# Altium project llrf_afe.PrjPcb (part 4 of 4)

## Sheet llrf_afe_fmc.SchDoc: =GlobalProjectName
size 410 x 297 mm; Author: Styuf Alexey; Organization: CosyLab Siberia; Revision: v0.8; SheetNumber: 14; SheetTotal: 20; PageSetup: Record=PageOptions|CenterHorizontal=True|CenterVertical=True|PrintScale=1.00|XCorrection=1.00|YCorrection=1.00|PrintKind=1|BorderSize=5000000|LeftOffset=0|BottomOffset=0|Orientation=2|PaperLength=1000|PaperWidth=1000|Scale=100|PaperSource=15|PrintQuality=1200|MediaType=1|DitherType=10|PaperKind=A3|PrintScaleMode=1; Weight: -; ScaleFactor: -
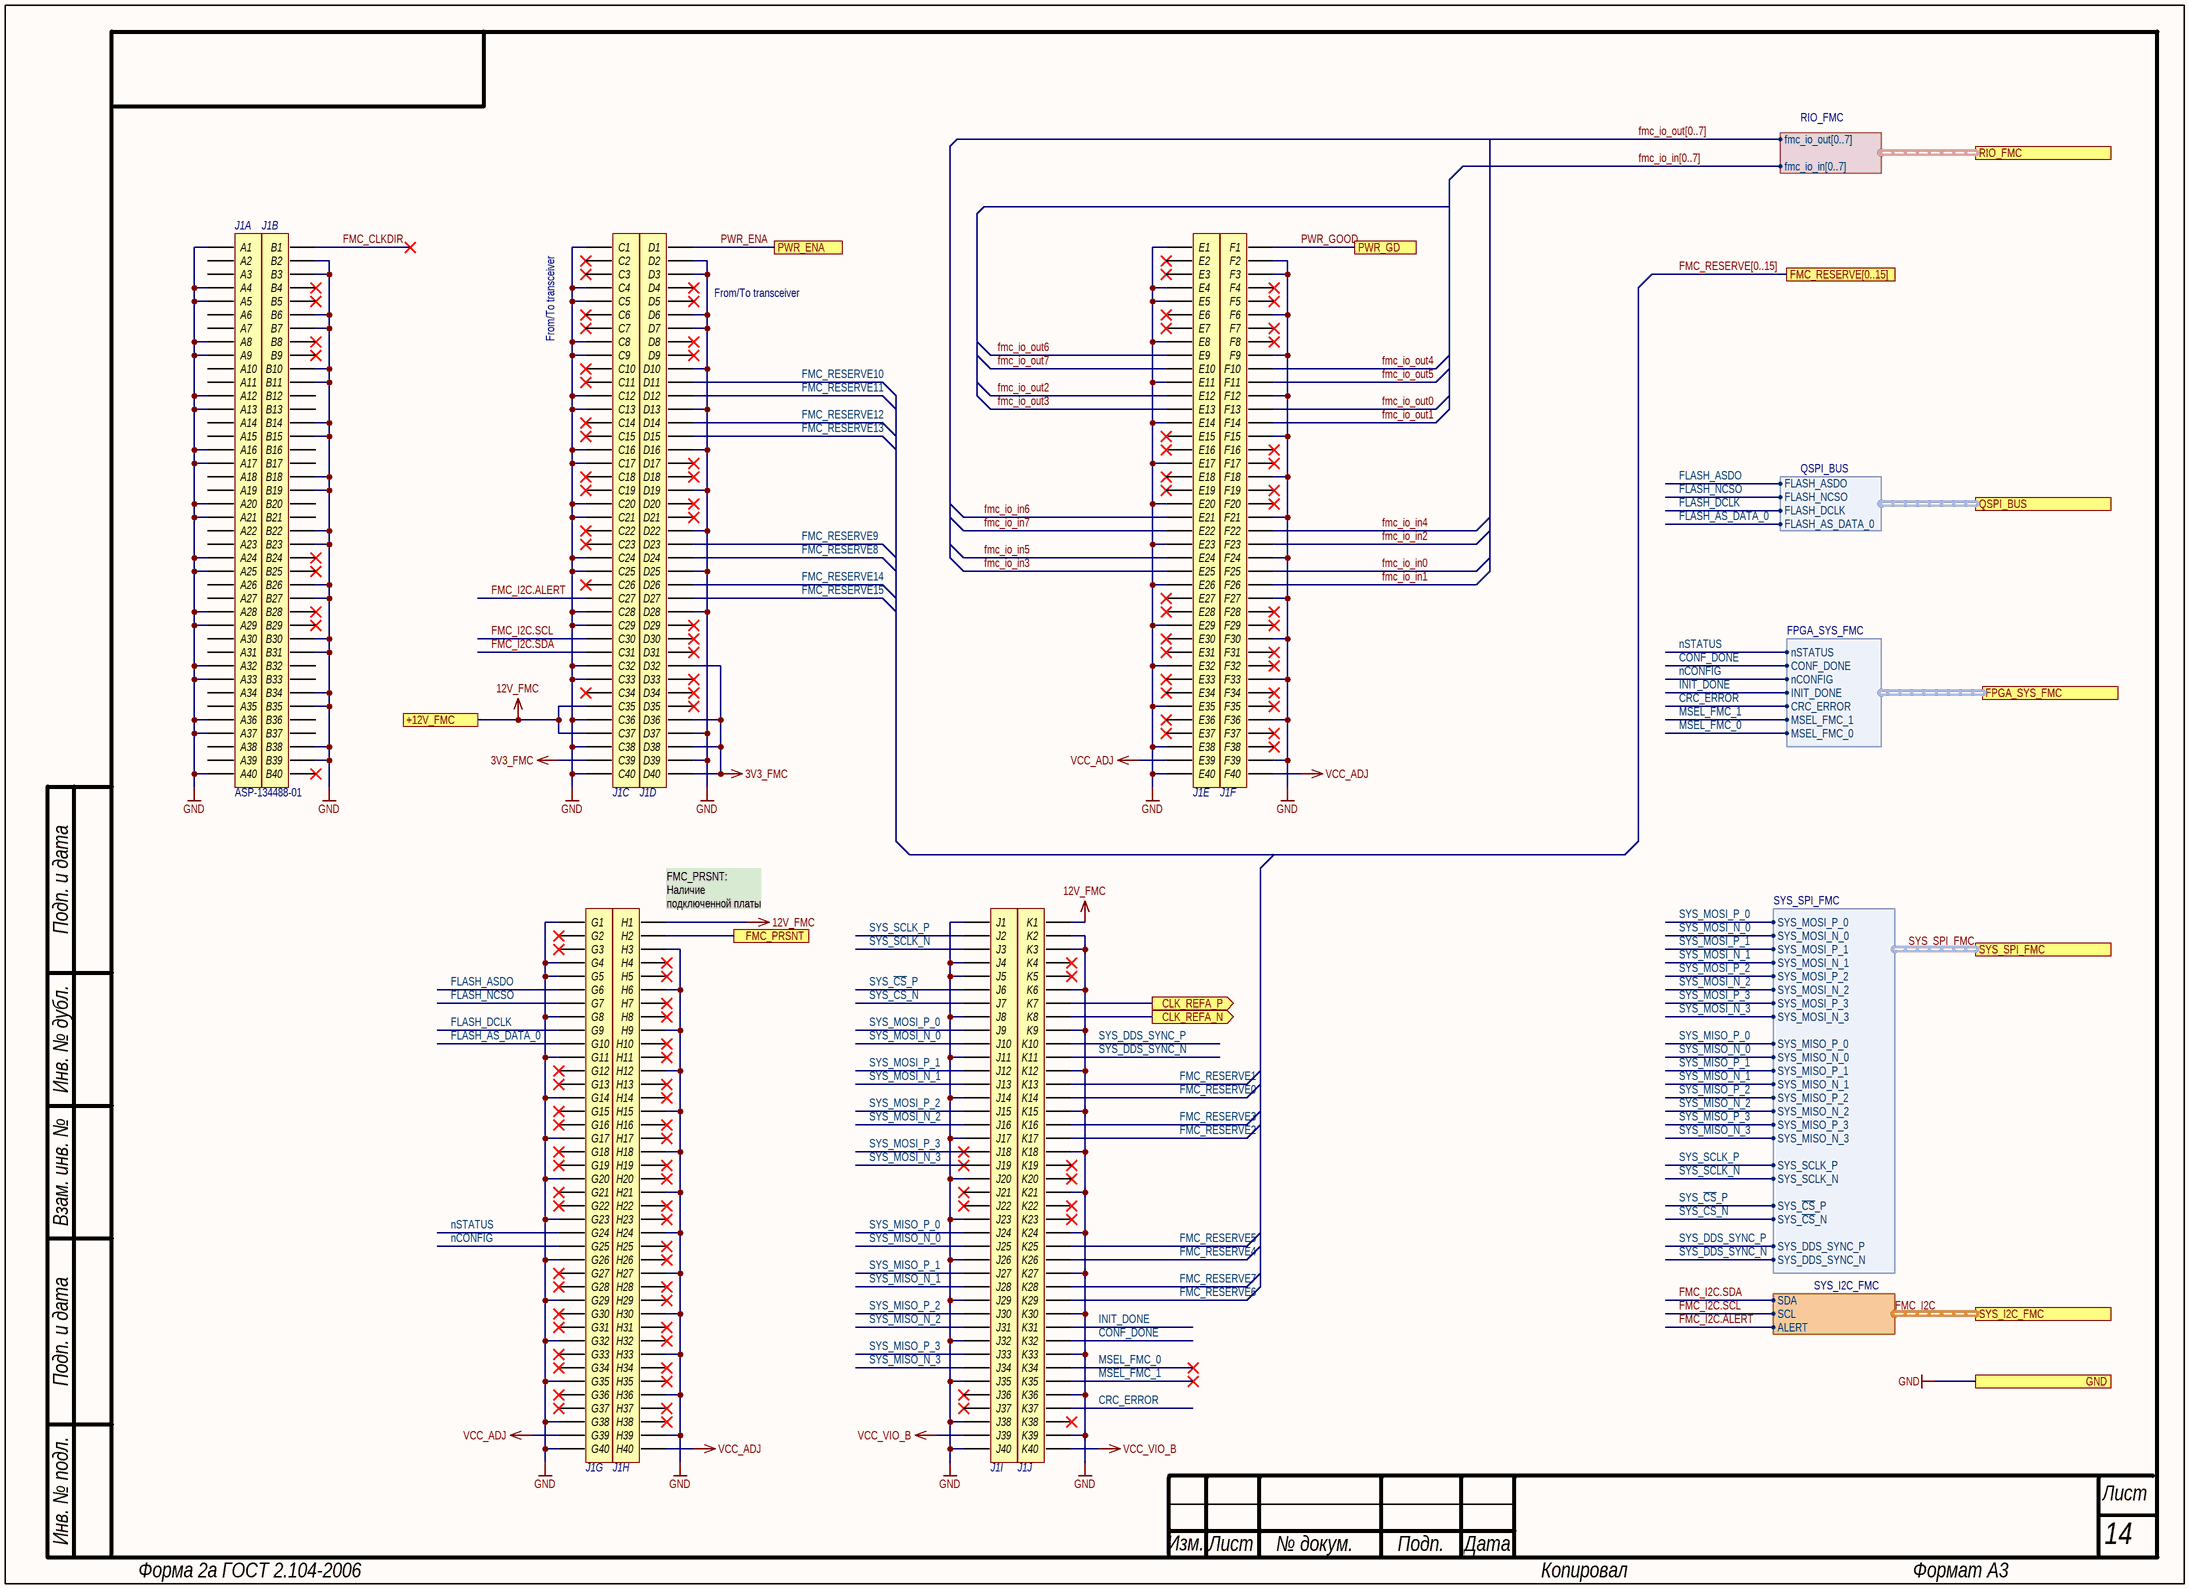
[diagram p22: llrf_afe_fmc.SchDoc]

### Parts
J1  ASP-134488-01  [ASP-134488-01]  (parts A,B,C,D,E,F,G,H,I,J of 10)

### Ports
+12V_FMC, CLK_REFA_N (out), CLK_REFA_P (out), FMC_PRSNT, FMC_RESERVE[0..15], FPGA_SYS_FMC (harness FPGA_SYS_FMC), GND, PWR_ENA, PWR_GD, QSPI_BUS (harness QSPI_BUS), RIO_FMC (harness RIO_FMC), SYS_I2C_FMC (harness SYS_I2C_FMC), SYS_SPI_FMC (harness SYS_SPI_FMC)

### Harnesses
RIO_FMC: fmc_io_out[0..7], fmc_io_in[0..7]
SYS_I2C_FMC: SDA, SCL, ALERT
SYS_SPI_FMC: SYS_MOSI_P_0, SYS_SCLK_P, SYS_~{CS}_P, SYS_MOSI_P_1, SYS_MOSI_P_2, SYS_MOSI_P_3, SYS_MOSI_N_0, SYS_MOSI_N_1, SYS_MOSI_N_2, SYS_MOSI_N_3, SYS_MISO_P_0, SYS_MISO_P_1, SYS_MISO_P_2, SYS_MISO_P_3, SYS_MISO_N_0, SYS_MISO_N_1, SYS_MISO_N_2, SYS_MISO_N_3, SYS_SCLK_N, SYS_DDS_SYNC_P, SYS_~{CS}_N, SYS_DDS_SYNC_N
QSPI_BUS: FLASH_ASDO, FLASH_NCSO, FLASH_DCLK, FLASH_AS_DATA_0
FPGA_SYS_FMC: INIT_DONE, nSTATUS, CONF_DONE, nCONFIG, MSEL_FMC_0, MSEL_FMC_1, CRC_ERROR

### Nets
3V3_FMC: J1.C39 J1.D32 J1.D36 J1.D38 J1.D40
12V_FMC: J1.C35 J1.C37 J1.H1 J1.K1 ; port +12V_FMC  [project net +12V_FMC]
GND: J1.A1 J1.A4 J1.A5 J1.A8 J1.A9 J1.A12 J1.A13 J1.A16 J1.A17 J1.A20 J1.A21 J1.A24 J1.A25 J1.A28 J1.A29 J1.A32 J1.A33 J1.A36 J1.A37 J1.A40 J1.B2 J1.B3 J1.B6 J1.B7 J1.B10 J1.B11 J1.B14 J1.B15 J1.B18 J1.B19 J1.B22 J1.B23 J1.B26 J1.B27 J1.B30 J1.B31 J1.B34 J1.B35 J1.B38 J1.B39 J1.C1 J1.C4 J1.C5 J1.C8 J1.C9 J1.C12 J1.C13 J1.C16 J1.C17 J1.C20 J1.C21 J1.C24 J1.C25 J1.C28 J1.C29 J1.C32 J1.C33 J1.C36 J1.C38 J1.C40 J1.D2 J1.D3 J1.D6 J1.D7 J1.D10 J1.D13 J1.D16 J1.D19 J1.D22 J1.D25 J1.D28 J1.D37 J1.D39 J1.E1 J1.E4 J1.E5 J1.E8 J1.E11 J1.E14 J1.E17 J1.E20 J1.E23 J1.E26 J1.E29 J1.E32 J1.E35 J1.E38 J1.E40 J1.F2 J1.F3 J1.F6 J1.F9 J1.F12 J1.F15 J1.F18 J1.F21 J1.F24 J1.F27 J1.F30 J1.F33 J1.F36 J1.F39 J1.G1 J1.G4 J1.G5 J1.G8 J1.G11 J1.G14 J1.G17 J1.G20 J1.G23 J1.G26 J1.G29 J1.G32 J1.G35 J1.G38 J1.G40 J1.H3 J1.H6 J1.H9 J1.H12 J1.H15 J1.H18 J1.H21 J1.H24 J1.H27 J1.H30 J1.H33 J1.H36 J1.H39 J1.J1 J1.J4 J1.J5 J1.J8 J1.J11 J1.J14 J1.J17 J1.J20 J1.J23 J1.J26 J1.J29 J1.J32 J1.J35 J1.J38 J1.J40 J1.K2 J1.K3 J1.K6 J1.K9 J1.K12 J1.K15 J1.K18 J1.K21 J1.K24 J1.K27 J1.K30 J1.K33 J1.K36 J1.K39 ; port GND
VCC_ADJ: J1.E39 J1.F40 J1.G39 J1.H40
VCC_VIO_B: J1.J39 J1.K40
CONF_DONE: J1.K32 ; port FPGA_SYS_FMC.CONF_DONE  [project net FPGA_SYS.CONF_DONE]
CRC_ERROR: J1.K37 ; port FPGA_SYS_FMC.CRC_ERROR  [project net FPGA_SYS.CRC_ERROR]
FLASH_AS_DATA_0: J1.G10 ; port QSPI_BUS.FLASH_AS_DATA_0
FLASH_ASDO: J1.G6 ; port QSPI_BUS.FLASH_ASDO
FLASH_DCLK: J1.G9 ; port QSPI_BUS.FLASH_DCLK
FLASH_NCSO: J1.G7 ; port QSPI_BUS.FLASH_NCSO
FMC_CLKDIR: J1.B1
FMC_I2C.ALERT: J1.C27 ; port SYS_I2C_FMC.ALERT
FMC_I2C.SCL: J1.C30 ; port SYS_I2C_FMC.SCL
FMC_I2C.SDA: J1.C31 ; port SYS_I2C_FMC.SDA
fmc_io_in0: J1.F25
fmc_io_in1: J1.F26
fmc_io_in2: J1.F23
fmc_io_in3: J1.E25
fmc_io_in4: J1.F22
fmc_io_in5: J1.E24
fmc_io_in6: J1.E21
fmc_io_in7: J1.E22
fmc_io_out0: J1.F13
fmc_io_out1: J1.F14
fmc_io_out2: J1.E12
fmc_io_out3: J1.E13
fmc_io_out4: J1.F10
fmc_io_out5: J1.F11
fmc_io_out6: J1.E9
fmc_io_out7: J1.E10
FMC_PRSNT: J1.H2 ; port FMC_PRSNT
FMC_RESERVE0: J1.K14
FMC_RESERVE1: J1.K13
FMC_RESERVE2: J1.K17
FMC_RESERVE3: J1.K16
FMC_RESERVE4: J1.K26
FMC_RESERVE5: J1.K25
FMC_RESERVE6: J1.K29
FMC_RESERVE7: J1.K28
FMC_RESERVE8: J1.D24
FMC_RESERVE9: J1.D23
FMC_RESERVE10: J1.D11
FMC_RESERVE11: J1.D12
FMC_RESERVE12: J1.D14
FMC_RESERVE13: J1.D15
FMC_RESERVE14: J1.D26
FMC_RESERVE15: J1.D27
INIT_DONE: J1.K31 ; port FPGA_SYS_FMC.INIT_DONE  [project net FPGA_SYS.INIT_DONE]
MSEL_FMC_0: J1.K34 ; port FPGA_SYS_FMC.MSEL_FMC_0
MSEL_FMC_1: J1.K35 ; port FPGA_SYS_FMC.MSEL_FMC_1
nCONFIG: J1.G25 ; port FPGA_SYS_FMC.nCONFIG  [project net FPGA_SYS.nCONFIG]
nSTATUS: J1.G24 ; port FPGA_SYS_FMC.nSTATUS  [project net FPGA_SYS.nSTATUS]
PWR_ENA: J1.D1 ; port PWR_ENA
PWR_GOOD: J1.F1 ; port PWR_GD  [project net PWR_GD]
REFA_N: J1.K8 ; port CLK_REFA_N
REFA_P: J1.K7 ; port CLK_REFA_P
SYS_~{CS}_N: J1.J7 ; port SYS_SPI_FMC.SYS_~{CS}_N  [project net SYS_SPI_FMC.SYS_~{CS}_N]
SYS_~{CS}_P: J1.J6 ; port SYS_SPI_FMC.SYS_~{CS}_P  [project net SYS_SPI_FMC.SYS_~{CS}_P]
SYS_DDS_SYNC_N: J1.K11 ; port SYS_SPI_FMC.SYS_DDS_SYNC_N  [project net SYS_SPI_FMC.SYS_DDS_SYNC_N]
SYS_DDS_SYNC_P: J1.K10 ; port SYS_SPI_FMC.SYS_DDS_SYNC_P  [project net SYS_SPI_FMC.SYS_DDS_SYNC_P]
SYS_MISO_N_0: J1.J25 ; port SYS_SPI_FMC.SYS_MISO_N_0  [project net SYS_SPI_FMC.SYS_MISO_N_0]
SYS_MISO_N_1: J1.J28 ; port SYS_SPI_FMC.SYS_MISO_N_1  [project net SYS_SPI_FMC.SYS_MISO_N_1]
SYS_MISO_N_2: J1.J31 ; port SYS_SPI_FMC.SYS_MISO_N_2  [project net SYS_SPI_FMC.SYS_MISO_N_2]
SYS_MISO_N_3: J1.J34 ; port SYS_SPI_FMC.SYS_MISO_N_3  [project net SYS_SPI_FMC.SYS_MISO_N_3]
SYS_MISO_P_0: J1.J24 ; port SYS_SPI_FMC.SYS_MISO_P_0  [project net SYS_SPI_FMC.SYS_MISO_P_0]
SYS_MISO_P_1: J1.J27 ; port SYS_SPI_FMC.SYS_MISO_P_1  [project net SYS_SPI_FMC.SYS_MISO_P_1]
SYS_MISO_P_2: J1.J30 ; port SYS_SPI_FMC.SYS_MISO_P_2  [project net SYS_SPI_FMC.SYS_MISO_P_2]
SYS_MISO_P_3: J1.J33 ; port SYS_SPI_FMC.SYS_MISO_P_3  [project net SYS_SPI_FMC.SYS_MISO_P_3]
SYS_MOSI_N_0: J1.J10 ; port SYS_SPI_FMC.SYS_MOSI_N_0  [project net SYS_SPI_FMC.SYS_MOSI_N_0]
SYS_MOSI_N_1: J1.J13 ; port SYS_SPI_FMC.SYS_MOSI_N_1  [project net SYS_SPI_FMC.SYS_MOSI_N_1]
SYS_MOSI_N_2: J1.J16 ; port SYS_SPI_FMC.SYS_MOSI_N_2  [project net SYS_SPI_FMC.SYS_MOSI_N_2]
SYS_MOSI_N_3: J1.J19 ; port SYS_SPI_FMC.SYS_MOSI_N_3  [project net SYS_SPI_FMC.SYS_MOSI_N_3]
SYS_MOSI_P_0: J1.J9 ; port SYS_SPI_FMC.SYS_MOSI_P_0  [project net SYS_SPI_FMC.SYS_MOSI_P_0]
SYS_MOSI_P_1: J1.J12 ; port SYS_SPI_FMC.SYS_MOSI_P_1  [project net SYS_SPI_FMC.SYS_MOSI_P_1]
SYS_MOSI_P_2: J1.J15 ; port SYS_SPI_FMC.SYS_MOSI_P_2  [project net SYS_SPI_FMC.SYS_MOSI_P_2]
SYS_MOSI_P_3: J1.J18 ; port SYS_SPI_FMC.SYS_MOSI_P_3  [project net SYS_SPI_FMC.SYS_MOSI_P_3]
SYS_SCLK_N: J1.J3 ; port SYS_SPI_FMC.SYS_SCLK_N  [project net SYS_SPI_FMC.SYS_SCLK_N]
SYS_SCLK_P: J1.J2 ; port SYS_SPI_FMC.SYS_SCLK_P  [project net SYS_SPI_FMC.SYS_SCLK_P]

Not connected (* = marked no-connect by the designer): J1 A2 A3 A6 A7 A10 A11 A14 A15 A18 A19 A22 A23 A26 A27 A30 A31 A34 A35 A38 A39 B4* B5* B8* B9* B12 B13 B16 B17 B20 B21 B24* B25* B28* B29* B32 B33 B36 B37 B40* C2* C3* C6* C7* C10* C11* C14* C15* C18* C19* C22* C23* C26* C34* D4* D5* D8* D9* D17* D18* D20* D21* D29* D30* D31* D33* D34* D35* E2* E3* E6* E7* E15* E16* E18* E19* E27* E28* E30* E31* E33* E34* E36* E37* F4* F5* F7* F8* F16* F17* F19* F20* F28* F29* F31* F32* F34* F35* F37* F38* G2* G3* G12* G13* G15* G16* G18* G19* G21* G22* G27* G28* G30* G31* G33* G34* G36* G37* H4* H5* H7* H8* H10* H11* H13* H14* H16* H17* H19* H20* H22* H23* H25* H26* H28* H29* H31* H32* H34* H35* H37* H38* J21* J22* J36* J37* K4* K5* K19* K20* K22* K23* K38*

### Buses and harness runs
bus fmc_io_in[0..7]
bus fmc_io_out[0..7]
bus FMC_RESERVE[0..15] = port FMC_RESERVE[0..15]
harness FMC_I2C = port SYS_I2C_FMC
harness SYS_SPI_FMC = port SYS_SPI_FMC

### Notes on the sheet
- (near J1) From/To transceiver
- (near J1) FMC_PRSNT:
  Наличие подключенной платы
- Подп. и дата
- Инв. № дубл.
- Взам. инв. №
- Инв. № подл.
- Изм.
- Лист
- № докум.
- Подп.
- Дата
- Форма 2а ГОСТ 2.104-2006
- Копировал
- Формат А3

### Library data of the parts
J1 = ASP-134488-01: Socket Array Assembly, Surface Mount, 0.050" Pitch, 400 Pins; MANUFACTURER: SAMTEC; PCB DECAL: SEAF-40-XX.X-XX-10-X-A; Потребление, Вт: 0,0; Назначение: FMC HPC socket Array Assembly, Surface Mount, 0.050" Pitch, 400 Pins; CREATED: March 24, 2015 - Wendy Xin; ComponentLink1Description: DataSheet; ComponentLink1URL: https://suddendocs.samtec.com/prints/asp-134488-01-mkt.pdf; Supplier 1: Digi-Key; Supplier Part Number 1: SAM8730-ND; Наименование: ASP-134488-01

## Nets that join several sheets
1V2: pwr/1V2_ctrl (R51_1V2_ctrl.1 TP14_1V2_ctrl.0 U14_1V2_ctrl.8 U14_1V2_ctrl.9), llrf_afe_fpga_pwr (56 pins)
1V8: llrf_afe_dds_clock (C115.2 L21.1), pwr/1V8_ctrl (R51_1V8_ctrl.1 TP14_1V8_ctrl.0 U14_1V8_ctrl.8 U14_1V8_ctrl.9), dds_channel_1 (9 pins), dds_channel_2 (9 pins)
2V5: llrf_afe_mfm (C4.2 C5.2 U3.2), pwr/2V5_ctrl (R51_2V5_ctrl.1 TP14_2V5_ctrl.0 U14_2V5_ctrl.8 U14_2V5_ctrl.9), llrf_afe_fpga_pwr (36 pins), llrf_afe_fpga_conf (11 pins)
3V3: llrf_afe_main (6 pins), llrf_afe_mfm (U3.15), llrf_afe_mfm_rio (C127.2 C128.2 U17.8), RIO/llrf_rio_ch0 (C38_llrf_rio_ch0.2 C39_llrf_rio_ch0.2 U7_llrf_rio_ch0.8), RIO/llrf_rio_ch1 (C38_llrf_rio_ch1.2 C39_llrf_rio_ch1.2 U7_llrf_rio_ch1.8), RIO/llrf_rio_ch2 (C38_llrf_rio_ch2.2 C39_llrf_rio_ch2.2 U7_llrf_rio_ch2.8), RIO/llrf_rio_ch3 (C38_llrf_rio_ch3.2 C39_llrf_rio_ch3.2 U7_llrf_rio_ch3.8), RIO/llrf_rio_ch4 (C38_llrf_rio_ch4.2 C39_llrf_rio_ch4.2 U7_llrf_rio_ch4.8), RIO/llrf_rio_ch5 (C38_llrf_rio_ch5.2 C39_llrf_rio_ch5.2 U7_llrf_rio_ch5.8), RIO/llrf_rio_ch6 (C38_llrf_rio_ch6.2 C39_llrf_rio_ch6.2 U7_llrf_rio_ch6.8), RIO/llrf_rio_ch7 (C38_llrf_rio_ch7.2 C39_llrf_rio_ch7.2 U7_llrf_rio_ch7.8), llrf_afe_system_ctrl (8 pins), llrf_afe_front_panel (X12.1 X12.3), llrf_afe_dds_clock (6 pins), llrf_afe_pwr (R29.1), pwr/3V3_ctrl (10 pins), pwr/2V5_ctrl (5 pins), pwr/1V8_ctrl (6 pins), pwr/12V_ctrl (5 pins), pwr/1V2_ctrl (6 pins), llrf_afe_fpga_pwr (32 pins), llrf_afe_usb_ftdi (6 pins), llrf_afe_fpga_conf (10 pins), dds_channel_1 (C23_dds_channel_1.2 C24_dds_channel_1.2 L7_dds_channel_1.1 U1_dds_channel_1.27), dds_channel_1/dds_filter_1 (10 pins), dds_channel_1/dds_filter_2 (10 pins), dds_channel_2 (C23_dds_channel_2.2 C24_dds_channel_2.2 L7_dds_channel_2.1 U1_dds_channel_2.27), dds_channel_2/dds_filter_1 (10 pins), dds_channel_2/dds_filter_2 (10 pins)
12V: llrf_afe_pwr (C47.1 G1.1), pwr/3V3_pwr (C55_3V3_pwr.2 C164_3V3_pwr.2 R_EN1_3V3_pwr.2 U21_3V3_pwr.6), pwr/2V5_pwr (C55_2V5_pwr.2 C164_2V5_pwr.2 R_EN1_2V5_pwr.2 U21_2V5_pwr.6), pwr/1V8_pwr (C55_1V8_pwr.2 C164_1V8_pwr.2 R_EN1_1V8_pwr.2 U21_1V8_pwr.6), pwr/12V_ctrl (R51_12V_ctrl.1 TP14_12V_ctrl.0 U14_12V_ctrl.8 U14_12V_ctrl.9), pwr/1V2_pwr (C55_1V2_pwr.2 C164_1V2_pwr.2 R_EN1_1V2_pwr.2 U21_1V2_pwr.6)
+5V: llrf_afe_pwr (C51.2 R36.2 U11.5), dds_channel_1 (C27_dds_channel_1.2 C28_dds_channel_1.2 L9_dds_channel_1.1), dds_channel_2 (C27_dds_channel_2.2 C28_dds_channel_2.2 L9_dds_channel_2.1)
+5V_A: dds_channel_1 (C29_dds_channel_1.2 C30_dds_channel_1.2 L9_dds_channel_1.2), dds_channel_1/dds_filter_1 (R126_dds_channel_1_dds_filter_1.1 R133_dds_channel_1_dds_filter_1.2), dds_channel_1/dds_filter_2 (R126_dds_channel_1_dds_filter_2.1 R133_dds_channel_1_dds_filter_2.2)
+5V_A: dds_channel_2 (C29_dds_channel_2.2 C30_dds_channel_2.2 L9_dds_channel_2.2), dds_channel_2/dds_filter_1 (R126_dds_channel_2_dds_filter_1.1 R133_dds_channel_2_dds_filter_1.2), dds_channel_2/dds_filter_2 (R126_dds_channel_2_dds_filter_2.1 R133_dds_channel_2_dds_filter_2.2)
+10V: llrf_afe_mfm (C173.2 C174.2 L2.1), llrf_afe_pwr (C44.2 R30.2 U9.5)
+12V_FMC: llrf_afe_pwr_input (5 pins), llrf_afe_fmc (J1.C35 J1.C37 J1.H1 J1.K1)
+12V_INPUT: llrf_afe_main (X1.1 X1.2 X1.3 X1.4), llrf_afe_pwr_input (5 pins)
-5V: llrf_afe_pwr (C54.1 R41.1 U12.5), dds_channel_1 (C31_dds_channel_1.2 C32_dds_channel_1.2 L10_dds_channel_1.1), dds_channel_2 (C31_dds_channel_2.2 C32_dds_channel_2.2 L10_dds_channel_2.1)
-5V_A: dds_channel_1 (C33_dds_channel_1.2 C34_dds_channel_1.2 L10_dds_channel_1.2), dds_channel_1/dds_filter_1 (R134_dds_channel_1_dds_filter_1.1), dds_channel_1/dds_filter_2 (R134_dds_channel_1_dds_filter_2.1)
-5V_A: dds_channel_2 (C33_dds_channel_2.2 C34_dds_channel_2.2 L10_dds_channel_2.2), dds_channel_2/dds_filter_1 (R134_dds_channel_2_dds_filter_1.1), dds_channel_2/dds_filter_2 (R134_dds_channel_2_dds_filter_2.1)
-10V: llrf_afe_mfm (C177.2 C178.2 L3.1), llrf_afe_pwr (C50.1 R35.1 U10.5)
AGND_DDS: dds_channel_1 (20 pins), dds_channel_1/dds_filter_1 (21 pins), dds_channel_1/dds_filter_2 (21 pins)
AGND_DDS: dds_channel_2 (20 pins), dds_channel_2/dds_filter_1 (21 pins), dds_channel_2/dds_filter_2 (21 pins)
GND: llrf_afe_main (10 pins), llrf_afe_mfm (5 pins), llrf_afe_mfm_rio (8 pins), RIO/llrf_rio_ch0 (5 pins), RIO/llrf_rio_ch1 (5 pins), RIO/llrf_rio_ch2 (5 pins), RIO/llrf_rio_ch3 (5 pins), RIO/llrf_rio_ch4 (5 pins), RIO/llrf_rio_ch5 (5 pins), RIO/llrf_rio_ch6 (5 pins), RIO/llrf_rio_ch7 (5 pins), llrf_afe_system_ctrl (11 pins), llrf_afe_fpga_bridge (12 pins), llrf_afe_front_panel (24 pins), llrf_afe_dds_clock (28 pins), llrf_afe_pwr (23 pins), pwr/3V3_pwr (10 pins), pwr/2V5_pwr (10 pins), pwr/1V8_pwr (10 pins), pwr/3V3_ctrl (C124_3V3_ctrl.1 D1_3V3_ctrl.2 R56_3V3_ctrl.1 U14_3V3_ctrl.7), pwr/2V5_ctrl (C124_2V5_ctrl.1 D1_2V5_ctrl.2 R56_2V5_ctrl.1 U14_2V5_ctrl.7), pwr/1V8_ctrl (C124_1V8_ctrl.1 D1_1V8_ctrl.2 U14_1V8_ctrl.7), pwr/12V_ctrl (5 pins), pwr/1V2_pwr (10 pins), pwr/1V2_ctrl (C124_1V2_ctrl.1 D1_1V2_ctrl.2 R55_1V2_ctrl.1 U14_1V2_ctrl.7), llrf_afe_pwr_input (16 pins), llrf_afe_fpga_pwr (105 pins), llrf_afe_usb_ftdi (13 pins), llrf_afe_fpga_conf (15 pins), llrf_afe_reserve_io (10 pins), dds_channel_1 (27 pins), dds_channel_1/dds_filter_1 (14 pins), dds_channel_1/dds_filter_2 (14 pins), dds_channel_2 (27 pins), dds_channel_2/dds_filter_1 (14 pins), dds_channel_2/dds_filter_2 (14 pins), llrf_afe_fmc (159 pins)
12V_OUT: pwr/12V_ctrl (R51_12V_ctrl.2 R52_12V_ctrl.1 U14_12V_ctrl.10), llrf_afe_pwr_input (5 pins)
B+: llrf_afe_mfm_rio (R74.2), llrf_afe_front_panel (X8.1)
B-: llrf_afe_mfm_rio (R76.2), llrf_afe_front_panel (X9.1)
B_REF: llrf_afe_mfm_rio (R72.2), llrf_afe_front_panel (X10.1)
~{CS}: llrf_afe_fpga_bridge (U8.H1), llrf_afe_dds_clock (U13.15)
CLK0_N: llrf_afe_dds_clock (U13.40), dds_channel_1 (C144_dds_channel_1.2)
CLK0_P: llrf_afe_dds_clock (U13.41), dds_channel_1 (C143_dds_channel_1.2)
CLK1_N: llrf_afe_dds_clock (U13.37), dds_channel_2 (C144_dds_channel_2.2)
CLK1_P: llrf_afe_dds_clock (U13.38), dds_channel_2 (C143_dds_channel_2.2)
CLK2_N: llrf_afe_fpga_bridge (C41.2), llrf_afe_dds_clock (U13.32)
CLK2_P: llrf_afe_fpga_bridge (C40.1), llrf_afe_dds_clock (U13.33)
CLK3_N: llrf_afe_fpga_bridge (C43.2), llrf_afe_dds_clock (U13.29)
CLK3_P: llrf_afe_fpga_bridge (C42.1), llrf_afe_dds_clock (U13.30)
CLK4_N: llrf_afe_main (R1.1), llrf_afe_dds_clock (U13.22)
CLK4_P: llrf_afe_main (R1.2), llrf_afe_dds_clock (U13.23)
CLK_REFB_N: llrf_afe_fpga_bridge (R175.2 R177.2), llrf_afe_dds_clock (C103.1)
CLK_REFB_P: llrf_afe_fpga_bridge (R175.1 R176.2), llrf_afe_dds_clock (C102.2)
DAC_OUT_N: dds_channel_1 (R110_dds_channel_1.2 U1_dds_channel_1.68), dds_channel_1/dds_filter_1 (R124_dds_channel_1_dds_filter_1.2 T1_dds_channel_1_dds_filter_1.6)
DAC_OUT_N: dds_channel_1 (R114_dds_channel_1.2 U1_dds_channel_1.60), dds_channel_1/dds_filter_2 (R124_dds_channel_1_dds_filter_2.2 T1_dds_channel_1_dds_filter_2.6)
DAC_OUT_N: dds_channel_2 (R110_dds_channel_2.2 U1_dds_channel_2.68), dds_channel_2/dds_filter_1 (R124_dds_channel_2_dds_filter_1.2 T1_dds_channel_2_dds_filter_1.6)
DAC_OUT_N: dds_channel_2 (R114_dds_channel_2.2 U1_dds_channel_2.60), dds_channel_2/dds_filter_2 (R124_dds_channel_2_dds_filter_2.2 T1_dds_channel_2_dds_filter_2.6)
DAC_OUT_P: dds_channel_1 (R109_dds_channel_1.2 U1_dds_channel_1.69), dds_channel_1/dds_filter_1 (R124_dds_channel_1_dds_filter_1.1 T1_dds_channel_1_dds_filter_1.4)
DAC_OUT_P: dds_channel_1 (R113_dds_channel_1.2 U1_dds_channel_1.59), dds_channel_1/dds_filter_2 (R124_dds_channel_1_dds_filter_2.1 T1_dds_channel_1_dds_filter_2.4)
DAC_OUT_P: dds_channel_2 (R109_dds_channel_2.2 U1_dds_channel_2.69), dds_channel_2/dds_filter_1 (R124_dds_channel_2_dds_filter_1.1 T1_dds_channel_2_dds_filter_1.4)
DAC_OUT_P: dds_channel_2 (R113_dds_channel_2.2 U1_dds_channel_2.59), dds_channel_2/dds_filter_2 (R124_dds_channel_2_dds_filter_2.1 T1_dds_channel_2_dds_filter_2.4)
DDS_BUS_1.DAC_RST: llrf_afe_fpga_bridge (U8.U7), dds_channel_1 (R121_dds_channel_1.2 U1_dds_channel_1.53)
DDS_BUS_1.FB1: llrf_afe_fpga_bridge (U8.Y3), dds_channel_1/dds_filter_1 (R136_dds_channel_1_dds_filter_1.1)
DDS_BUS_1.FB2: llrf_afe_fpga_bridge (U8.V5), dds_channel_1/dds_filter_2 (R136_dds_channel_1_dds_filter_2.1)
DDS_BUS_1.P1D0: llrf_afe_fpga_bridge (U8.AB7), dds_channel_1 (U1_dds_channel_1.22)
DDS_BUS_1.P1D1: llrf_afe_fpga_bridge (U8.AA7), dds_channel_1 (U1_dds_channel_1.21)
DDS_BUS_1.P1D2: llrf_afe_fpga_bridge (U8.AA8), dds_channel_1 (U1_dds_channel_1.20)
DDS_BUS_1.P1D3: llrf_afe_fpga_bridge (U8.AB8), dds_channel_1 (U1_dds_channel_1.19)
DDS_BUS_1.P1D4: llrf_afe_fpga_bridge (U8.Y8), dds_channel_1 (U1_dds_channel_1.18)
DDS_BUS_1.P1D5: llrf_afe_fpga_bridge (U8.AA9), dds_channel_1 (U1_dds_channel_1.17)
DDS_BUS_1.P1D6: llrf_afe_fpga_bridge (U8.AB9), dds_channel_1 (U1_dds_channel_1.16)
DDS_BUS_1.P1D7: llrf_afe_fpga_bridge (U8.Y10), dds_channel_1 (U1_dds_channel_1.15)
DDS_BUS_1.P1D8: llrf_afe_fpga_bridge (U8.AA10), dds_channel_1 (U1_dds_channel_1.14)
DDS_BUS_1.P1D9: llrf_afe_fpga_bridge (U8.AB10), dds_channel_1 (U1_dds_channel_1.13)
DDS_BUS_1.P1D10: llrf_afe_fpga_bridge (U8.W10), dds_channel_1 (U1_dds_channel_1.12)
DDS_BUS_1.P1D11: llrf_afe_fpga_bridge (U8.V11), dds_channel_1 (U1_dds_channel_1.11)
DDS_BUS_1.P1D12: llrf_afe_fpga_bridge (U8.U11), dds_channel_1 (U1_dds_channel_1.10)
DDS_BUS_1.P1D13: llrf_afe_fpga_bridge (U8.T11), dds_channel_1 (U1_dds_channel_1.9)
DDS_BUS_1.P2D0: llrf_afe_fpga_bridge (U8.V6), dds_channel_1 (U1_dds_channel_1.44)
DDS_BUS_1.P2D1: llrf_afe_fpga_bridge (U8.Y4), dds_channel_1 (U1_dds_channel_1.43)
DDS_BUS_1.P2D2: llrf_afe_fpga_bridge (U8.V7), dds_channel_1 (U1_dds_channel_1.42)
DDS_BUS_1.P2D3: llrf_afe_fpga_bridge (U8.W6), dds_channel_1 (U1_dds_channel_1.41)
DDS_BUS_1.P2D4: llrf_afe_fpga_bridge (U8.AA4), dds_channel_1 (U1_dds_channel_1.40)
DDS_BUS_1.P2D5: llrf_afe_fpga_bridge (U8.W7), dds_channel_1 (U1_dds_channel_1.39)
DDS_BUS_1.P2D6: llrf_afe_fpga_bridge (U8.AB4), dds_channel_1 (U1_dds_channel_1.38)
DDS_BUS_1.P2D7: llrf_afe_fpga_bridge (U8.AA5), dds_channel_1 (U1_dds_channel_1.37)
DDS_BUS_1.P2D8: llrf_afe_fpga_bridge (U8.U8), dds_channel_1 (U1_dds_channel_1.36)
DDS_BUS_1.P2D9: llrf_afe_fpga_bridge (U8.AB5), dds_channel_1 (U1_dds_channel_1.35)
DDS_BUS_1.P2D10: llrf_afe_fpga_bridge (U8.V8), dds_channel_1 (U1_dds_channel_1.34)
DDS_BUS_1.P2D11: llrf_afe_fpga_bridge (U8.AA6), dds_channel_1 (U1_dds_channel_1.33)
DDS_BUS_1.P2D12: llrf_afe_fpga_bridge (U8.AB6), dds_channel_1 (U1_dds_channel_1.32)
DDS_BUS_1.P2D13: llrf_afe_fpga_bridge (U8.Y7), dds_channel_1 (U1_dds_channel_1.31)
DDS_BUS_1.SLEEP: llrf_afe_fpga_bridge (U8.W8), dds_channel_1 (R174_dds_channel_1.2 U1_dds_channel_1.52)
DDS_BUS_2.DAC_RST: llrf_afe_fpga_bridge (U8.N7), dds_channel_2 (R121_dds_channel_2.2 U1_dds_channel_2.53)
DDS_BUS_2.FB1: llrf_afe_fpga_bridge (U8.Y2), dds_channel_2/dds_filter_1 (R136_dds_channel_2_dds_filter_1.1)
DDS_BUS_2.FB2: llrf_afe_fpga_bridge (U8.Y1), dds_channel_2/dds_filter_2 (R136_dds_channel_2_dds_filter_2.1)
DDS_BUS_2.P1D0: llrf_afe_fpga_bridge (U8.P7), dds_channel_2 (U1_dds_channel_2.22)
DDS_BUS_2.P1D1: llrf_afe_fpga_bridge (U8.R1), dds_channel_2 (U1_dds_channel_2.21)
DDS_BUS_2.P1D2: llrf_afe_fpga_bridge (U8.R2), dds_channel_2 (U1_dds_channel_2.20)
DDS_BUS_2.P1D3: llrf_afe_fpga_bridge (U8.R3), dds_channel_2 (U1_dds_channel_2.19)
DDS_BUS_2.P1D4: llrf_afe_fpga_bridge (U8.R5), dds_channel_2 (U1_dds_channel_2.18)
DDS_BUS_2.P1D5: llrf_afe_fpga_bridge (U8.T5), dds_channel_2 (U1_dds_channel_2.17)
DDS_BUS_2.P1D6: llrf_afe_fpga_bridge (U8.U1), dds_channel_2 (U1_dds_channel_2.16)
DDS_BUS_2.P1D7: llrf_afe_fpga_bridge (U8.U2), dds_channel_2 (U1_dds_channel_2.15)
DDS_BUS_2.P1D8: llrf_afe_fpga_bridge (U8.P6), dds_channel_2 (U1_dds_channel_2.14)
DDS_BUS_2.P1D9: llrf_afe_fpga_bridge (U8.V1), dds_channel_2 (U1_dds_channel_2.13)
DDS_BUS_2.P1D10: llrf_afe_fpga_bridge (U8.V2), dds_channel_2 (U1_dds_channel_2.12)
DDS_BUS_2.P1D11: llrf_afe_fpga_bridge (U8.R6), dds_channel_2 (U1_dds_channel_2.11)
DDS_BUS_2.P1D12: llrf_afe_fpga_bridge (U8.W1), dds_channel_2 (U1_dds_channel_2.10)
DDS_BUS_2.P1D13: llrf_afe_fpga_bridge (U8.W2), dds_channel_2 (U1_dds_channel_2.9)
DDS_BUS_2.P2D0: llrf_afe_fpga_bridge (U8.M4), dds_channel_2 (U1_dds_channel_2.44)
DDS_BUS_2.P2D1: llrf_afe_fpga_bridge (U8.N5), dds_channel_2 (U1_dds_channel_2.43)
DDS_BUS_2.P2D2: llrf_afe_fpga_bridge (U8.N6), dds_channel_2 (U1_dds_channel_2.42)
DDS_BUS_2.P2D3: llrf_afe_fpga_bridge (U8.P5), dds_channel_2 (U1_dds_channel_2.41)
DDS_BUS_2.P2D4: llrf_afe_fpga_bridge (U8.L6), dds_channel_2 (U1_dds_channel_2.40)
DDS_BUS_2.P2D5: llrf_afe_fpga_bridge (U8.M6), dds_channel_2 (U1_dds_channel_2.39)
DDS_BUS_2.P2D6: llrf_afe_fpga_bridge (U8.M3), dds_channel_2 (U1_dds_channel_2.38)
DDS_BUS_2.P2D7: llrf_afe_fpga_bridge (U8.M2), dds_channel_2 (U1_dds_channel_2.37)
DDS_BUS_2.P2D8: llrf_afe_fpga_bridge (U8.M1), dds_channel_2 (U1_dds_channel_2.36)
DDS_BUS_2.P2D9: llrf_afe_fpga_bridge (U8.P4), dds_channel_2 (U1_dds_channel_2.35)
DDS_BUS_2.P2D10: llrf_afe_fpga_bridge (U8.N2), dds_channel_2 (U1_dds_channel_2.34)
DDS_BUS_2.P2D11: llrf_afe_fpga_bridge (U8.N1), dds_channel_2 (U1_dds_channel_2.33)
DDS_BUS_2.P2D12: llrf_afe_fpga_bridge (U8.P3), dds_channel_2 (U1_dds_channel_2.32)
DDS_BUS_2.P2D13: llrf_afe_fpga_bridge (U8.P2), dds_channel_2 (U1_dds_channel_2.31)
DDS_BUS_2.SLEEP: llrf_afe_fpga_bridge (U8.P1), dds_channel_2 (R174_dds_channel_2.2 U1_dds_channel_2.52)
DDS_OUT+_1: llrf_afe_front_panel (X3.1), dds_channel_1/dds_filter_1 (R128_dds_channel_1_dds_filter_1.2)
DDS_OUT+_2: llrf_afe_front_panel (X4.1), dds_channel_1/dds_filter_2 (R128_dds_channel_1_dds_filter_2.2)
DDS_OUT+_3: llrf_afe_front_panel (X5.1), dds_channel_2/dds_filter_1 (R128_dds_channel_2_dds_filter_1.2)
DDS_OUT+_4: llrf_afe_front_panel (X6.1), dds_channel_2/dds_filter_2 (R128_dds_channel_2_dds_filter_2.2)
DDS_OUT-_1: llrf_afe_front_panel (C105.2 X3.2), dds_channel_1/dds_filter_1 (R131_dds_channel_1_dds_filter_1.2)
DDS_OUT-_2: llrf_afe_front_panel (C184.2 X4.2), dds_channel_1/dds_filter_2 (R131_dds_channel_1_dds_filter_2.2)
DDS_OUT-_3: llrf_afe_front_panel (C185.2 X5.2), dds_channel_2/dds_filter_1 (R131_dds_channel_2_dds_filter_1.2)
DDS_OUT-_4: llrf_afe_front_panel (C186.2 X6.2), dds_channel_2/dds_filter_2 (R131_dds_channel_2_dds_filter_2.2)
ENA: pwr/3V3_pwr (C55_3V3_pwr.1 R_EN1_3V3_pwr.1 R_EN2_3V3_pwr.2 U21_3V3_pwr.1), pwr/2V5_pwr (R165_2V5_pwr.1)
ENA: pwr/2V5_pwr (C55_2V5_pwr.1 R_EN1_2V5_pwr.1 R_EN2_2V5_pwr.2 U21_2V5_pwr.1), pwr/1V8_pwr (R165_1V8_pwr.1)
ENA: pwr/1V8_pwr (C55_1V8_pwr.1 R_EN1_1V8_pwr.1 R_EN2_1V8_pwr.2 U21_1V8_pwr.1), pwr/1V2_pwr (R165_1V2_pwr.1)
FLASH_AS_DATA_0: llrf_afe_fpga_bridge (U8.K1), llrf_afe_fpga_conf (R100.2), llrf_afe_fmc (J1.G10)
FLASH_ASDO: llrf_afe_fpga_bridge (U8.D1), llrf_afe_fpga_conf (R171.2), llrf_afe_fmc (J1.G6)
FLASH_DCLK: llrf_afe_fpga_bridge (U8.K2), llrf_afe_fpga_conf (U32.6), llrf_afe_fmc (J1.G9)
FLASH_NCSO: llrf_afe_fpga_bridge (U8.E2), llrf_afe_fpga_conf (U32.1), llrf_afe_fmc (J1.G7)
FMC_I2C.ALERT: llrf_afe_main (R4.1 VD3.1), llrf_afe_system_ctrl (R62.1 R67.2 R69.1), llrf_afe_fpga_bridge (U8.J3), pwr/3V3_ctrl (R54_3V3_ctrl.1), pwr/2V5_ctrl (R54_2V5_ctrl.1), pwr/1V8_ctrl (R54_1V8_ctrl.1), pwr/12V_ctrl (R54_12V_ctrl.1), pwr/1V2_ctrl (R54_1V2_ctrl.1), llrf_afe_fmc (J1.C27)
FMC_I2C.SCL: llrf_afe_main (R3.1 VD2.1), llrf_afe_system_ctrl (R66.2 U15.2 U16.2), llrf_afe_fpga_bridge (U8.C2), pwr/3V3_ctrl (R172_3V3_ctrl.1 U14_3V3_ctrl.5), pwr/2V5_ctrl (R172_2V5_ctrl.1 U14_2V5_ctrl.5), pwr/1V8_ctrl (R55_1V8_ctrl.1 R172_1V8_ctrl.1 U14_1V8_ctrl.5), pwr/12V_ctrl (R172_12V_ctrl.1 U14_12V_ctrl.5), pwr/1V2_ctrl (R172_1V2_ctrl.1 U14_1V2_ctrl.5), llrf_afe_fmc (J1.C30)
FMC_I2C.SDA: llrf_afe_main (R2.1 VD1.1), llrf_afe_system_ctrl (R65.2 U15.1 U16.1), llrf_afe_fpga_bridge (U8.C1), pwr/3V3_ctrl (R173_3V3_ctrl.1 U14_3V3_ctrl.4), pwr/2V5_ctrl (R55_2V5_ctrl.1 R173_2V5_ctrl.1 U14_2V5_ctrl.4), pwr/1V8_ctrl (R173_1V8_ctrl.1 U14_1V8_ctrl.4), pwr/12V_ctrl (R173_12V_ctrl.1 U14_12V_ctrl.4), pwr/1V2_ctrl (R173_1V2_ctrl.1 U14_1V2_ctrl.4), llrf_afe_fmc (J1.C31)
fmc_io_in0: llrf_afe_fpga_bridge (R160.8), llrf_afe_fmc (J1.F25)
fmc_io_in1: llrf_afe_fpga_bridge (R160.7), llrf_afe_fmc (J1.F26)
fmc_io_in2: llrf_afe_fpga_bridge (R160.6), llrf_afe_fmc (J1.F23)
fmc_io_in3: llrf_afe_fpga_bridge (R160.5), llrf_afe_fmc (J1.E25)
fmc_io_in4: llrf_afe_fpga_bridge (R162.8), llrf_afe_fmc (J1.F22)
fmc_io_in5: llrf_afe_fpga_bridge (R162.7), llrf_afe_fmc (J1.E24)
fmc_io_in6: llrf_afe_fpga_bridge (R162.6), llrf_afe_fmc (J1.E21)
fmc_io_in7: llrf_afe_fpga_bridge (R162.5), llrf_afe_fmc (J1.E22)
fmc_io_out0: llrf_afe_fpga_bridge (R161.8), llrf_afe_fmc (J1.F13)
fmc_io_out1: llrf_afe_fpga_bridge (R161.7), llrf_afe_fmc (J1.F14)
fmc_io_out2: llrf_afe_fpga_bridge (R161.6), llrf_afe_fmc (J1.E12)
fmc_io_out3: llrf_afe_fpga_bridge (R161.5), llrf_afe_fmc (J1.E13)
fmc_io_out4: llrf_afe_fpga_bridge (R163.8), llrf_afe_fmc (J1.F10)
fmc_io_out5: llrf_afe_fpga_bridge (R163.7), llrf_afe_fmc (J1.F11)
fmc_io_out6: llrf_afe_fpga_bridge (R163.6), llrf_afe_fmc (J1.E9)
fmc_io_out7: llrf_afe_fpga_bridge (R163.5), llrf_afe_fmc (J1.E10)
FMC_PRSNT: llrf_afe_main (R57.2), llrf_afe_fmc (J1.H2)
FMC_RESERVE0: llrf_afe_reserve_io (X16.1), llrf_afe_fmc (J1.K14)
FMC_RESERVE1: llrf_afe_reserve_io (X16.2), llrf_afe_fmc (J1.K13)
FMC_RESERVE2: llrf_afe_reserve_io (X16.3), llrf_afe_fmc (J1.K17)
FMC_RESERVE3: llrf_afe_reserve_io (X16.4), llrf_afe_fmc (J1.K16)
FMC_RESERVE4: llrf_afe_reserve_io (X16.5), llrf_afe_fmc (J1.K26)
FMC_RESERVE5: llrf_afe_reserve_io (X16.6), llrf_afe_fmc (J1.K25)
FMC_RESERVE6: llrf_afe_reserve_io (X16.7), llrf_afe_fmc (J1.K29)
FMC_RESERVE7: llrf_afe_reserve_io (X16.8), llrf_afe_fmc (J1.K28)
FMC_RESERVE8: llrf_afe_reserve_io (X25.1), llrf_afe_fmc (J1.D24)
FMC_RESERVE9: llrf_afe_reserve_io (X25.2), llrf_afe_fmc (J1.D23)
FMC_RESERVE10: llrf_afe_reserve_io (X25.3), llrf_afe_fmc (J1.D11)
FMC_RESERVE11: llrf_afe_reserve_io (X25.4), llrf_afe_fmc (J1.D12)
FMC_RESERVE12: llrf_afe_reserve_io (X25.5), llrf_afe_fmc (J1.D14)
FMC_RESERVE13: llrf_afe_reserve_io (X25.6), llrf_afe_fmc (J1.D15)
FMC_RESERVE14: llrf_afe_reserve_io (X25.7), llrf_afe_fmc (J1.D26)
FMC_RESERVE15: llrf_afe_reserve_io (X25.8), llrf_afe_fmc (J1.D27)
FPGA_RX: llrf_afe_fpga_bridge (U8.H4), llrf_afe_usb_ftdi (R179.1 TP11.0 U18.7)
FPGA_SYS.CONF_DONE: llrf_afe_fpga_bridge (U8.M18), llrf_afe_fpga_conf (R106.1), llrf_afe_fmc (J1.K32)
FPGA_SYS.CRC_ERROR: llrf_afe_fpga_bridge (U8.L21), llrf_afe_fpga_conf (R108.1), llrf_afe_fmc (J1.K37)
FPGA_SYS.INIT_DONE: llrf_afe_fpga_bridge (U8.L22), llrf_afe_fpga_conf (R107.1), llrf_afe_fmc (J1.K31)
FPGA_SYS.MSEL_0: llrf_afe_fpga_bridge (U8.M17), llrf_afe_fpga_conf (RJ6.1 U22.5)
FPGA_SYS.MSEL_1: llrf_afe_fpga_bridge (U8.L18), llrf_afe_fpga_conf (RJ4.1 U22.7)
FPGA_SYS.MSEL_2: llrf_afe_fpga_bridge (U8.L17), llrf_afe_fpga_conf (RJ2.1)
FPGA_SYS.MSEL_3: llrf_afe_fpga_bridge (U8.K20), llrf_afe_fpga_conf (RJ1.1)
FPGA_SYS.nCONFIG: llrf_afe_fpga_bridge (U8.K5), llrf_afe_fpga_conf (R105.1), llrf_afe_fmc (J1.G25)
FPGA_SYS.nSTATUS: llrf_afe_fpga_bridge (U8.K6), llrf_afe_fpga_conf (R104.1), llrf_afe_fmc (J1.G24)
FPGA_SYS.TCK: llrf_afe_fpga_bridge (U8.L2), llrf_afe_fpga_conf (R183.7)
FPGA_SYS.TDI: llrf_afe_fpga_bridge (U8.L5), llrf_afe_fpga_conf (R183.8)
FPGA_SYS.TDO: llrf_afe_fpga_bridge (U8.L4), llrf_afe_fpga_conf (R183.6)
FPGA_SYS.TMS: llrf_afe_fpga_bridge (U8.L1), llrf_afe_fpga_conf (R183.5)
FPGA_TX: llrf_afe_fpga_bridge (U8.H3), llrf_afe_usb_ftdi (R180.1 TP12.0 U18.10)
io_in0: RIO/llrf_rio_ch0 (R24_llrf_rio_ch0.1 R25_llrf_rio_ch0.2), llrf_afe_fpga_bridge (U8.Y14)
io_in1: RIO/llrf_rio_ch1 (R24_llrf_rio_ch1.1 R25_llrf_rio_ch1.2), llrf_afe_fpga_bridge (U8.AA13)
io_in2: RIO/llrf_rio_ch2 (R24_llrf_rio_ch2.1 R25_llrf_rio_ch2.2), llrf_afe_fpga_bridge (U8.W17)
io_in3: RIO/llrf_rio_ch3 (R24_llrf_rio_ch3.1 R25_llrf_rio_ch3.2), llrf_afe_fpga_bridge (U8.AA17)
io_in4: RIO/llrf_rio_ch4 (R24_llrf_rio_ch4.1 R25_llrf_rio_ch4.2), llrf_afe_fpga_bridge (U8.AB16)
io_in5: RIO/llrf_rio_ch5 (R24_llrf_rio_ch5.1 R25_llrf_rio_ch5.2), llrf_afe_fpga_bridge (U8.W15)
io_in6: RIO/llrf_rio_ch6 (R24_llrf_rio_ch6.1 R25_llrf_rio_ch6.2), llrf_afe_fpga_bridge (U8.AA15)
io_in7: RIO/llrf_rio_ch7 (R24_llrf_rio_ch7.1 R25_llrf_rio_ch7.2), llrf_afe_fpga_bridge (U8.AB14)
io_out0: RIO/llrf_rio_ch0 (R21_llrf_rio_ch0.1), llrf_afe_fpga_bridge (U8.AB13)
io_out1: RIO/llrf_rio_ch1 (R21_llrf_rio_ch1.1), llrf_afe_fpga_bridge (U8.Y13)
io_out2: RIO/llrf_rio_ch2 (R21_llrf_rio_ch2.1), llrf_afe_fpga_bridge (U8.AB17)
io_out3: RIO/llrf_rio_ch3 (R21_llrf_rio_ch3.1), llrf_afe_fpga_bridge (U8.Y17)
io_out4: RIO/llrf_rio_ch4 (R21_llrf_rio_ch4.1), llrf_afe_fpga_bridge (U8.AA16)
io_out5: RIO/llrf_rio_ch5 (R21_llrf_rio_ch5.1), llrf_afe_fpga_bridge (U8.AB15)
io_out6: RIO/llrf_rio_ch6 (R21_llrf_rio_ch6.1), llrf_afe_fpga_bridge (U8.Y15)
io_out7: RIO/llrf_rio_ch7 (R21_llrf_rio_ch7.1), llrf_afe_fpga_bridge (U8.AA14)
LED0: llrf_afe_fpga_bridge (R178.4), llrf_afe_front_panel (R58.1)
LED1: llrf_afe_fpga_bridge (R178.3), llrf_afe_front_panel (R60.1)
LED2: llrf_afe_fpga_bridge (R178.2), llrf_afe_front_panel (R59.2)
LED3: llrf_afe_fpga_bridge (R178.1), llrf_afe_front_panel (R164.2)
m_signal_n: llrf_afe_mfm (6 pins), llrf_afe_front_panel (X9.3)
m_signal_p: llrf_afe_mfm (5 pins), llrf_afe_front_panel (X8.3)
MFM_A0: llrf_afe_mfm (U2.1), llrf_afe_fpga_bridge (U8.J1)
MFM_A1: llrf_afe_mfm (U2.16), llrf_afe_fpga_bridge (U8.J4)
MFM_B+: llrf_afe_mfm_rio (R77.1 R78.2 TP4.0), llrf_afe_fpga_bridge (U8.G4)
MFM_B-: llrf_afe_mfm_rio (R79.1 R80.2 TP5.0), llrf_afe_fpga_bridge (U8.F1)
MFM_B_REF: llrf_afe_mfm_rio (R73.1 R75.2 TP2.0), llrf_afe_fpga_bridge (U8.F2)
MFM_BUSY: llrf_afe_mfm (U3.11), llrf_afe_fpga_bridge (U8.J6)
MFM_CNV: llrf_afe_mfm (U3.9), llrf_afe_fpga_bridge (U8.J2)
MFM_SCK: llrf_afe_mfm (U3.13), llrf_afe_fpga_bridge (U8.H6)
MFM_SDO: llrf_afe_mfm (U3.14), llrf_afe_fpga_bridge (U8.G3)
MSEL_FMC_0: llrf_afe_fpga_conf (RJ3.1 U22.3), llrf_afe_fmc (J1.K34)
MSEL_FMC_1: llrf_afe_fpga_conf (RJ5.1 U22.1), llrf_afe_fmc (J1.K35)
OUT_V: pwr/3V3_pwr (R42_3V3_pwr.1), pwr/3V3_ctrl (R51_3V3_ctrl.2 R52_3V3_ctrl.1 U14_3V3_ctrl.10)
OUT_V: pwr/2V5_pwr (R42_2V5_pwr.1), pwr/2V5_ctrl (R51_2V5_ctrl.2 R52_2V5_ctrl.1 U14_2V5_ctrl.10)
OUT_V: pwr/1V8_pwr (R42_1V8_pwr.1), pwr/1V8_ctrl (R51_1V8_ctrl.2 R52_1V8_ctrl.1 U14_1V8_ctrl.10)
OUT_V: pwr/1V2_pwr (R42_1V2_pwr.1), pwr/1V2_ctrl (R51_1V2_ctrl.2 R52_1V2_ctrl.1 U14_1V2_ctrl.10)
PWR_ENA: llrf_afe_pwr_input (R92.2), llrf_afe_fmc (J1.D1)
PWR_GD: llrf_afe_pwr (R29.2), pwr/3V3_pwr (R165_3V3_pwr.1), llrf_afe_pwr_input (R95.1 R96.1), llrf_afe_fmc (J1.F1)
~{RESET}: llrf_afe_fpga_bridge (U8.D2), llrf_afe_dds_clock (U13.26)
REF_SEL: llrf_afe_fpga_bridge (U8.E1), llrf_afe_dds_clock (U13.45)
REFA_N: llrf_afe_dds_clock (C101.1), llrf_afe_fmc (J1.K8)
REFA_P: llrf_afe_dds_clock (C100.2), llrf_afe_fmc (J1.K7)
RESERVE_2V5_0: llrf_afe_fpga_bridge (U8.A6), llrf_afe_reserve_io (X19.1)
RESERVE_2V5_1: llrf_afe_fpga_bridge (U8.B6), llrf_afe_reserve_io (X19.2)
RESERVE_2V5_2: llrf_afe_fpga_bridge (U8.B7), llrf_afe_reserve_io (X19.3)
RESERVE_2V5_3: llrf_afe_fpga_bridge (U8.A5), llrf_afe_reserve_io (X19.4)
RESERVE_2V5_4: llrf_afe_fpga_bridge (U8.A7), llrf_afe_reserve_io (X19.5)
RESERVE_2V5_5: llrf_afe_fpga_bridge (U8.B4), llrf_afe_reserve_io (X19.6)
RESERVE_2V5_6: llrf_afe_fpga_bridge (U8.A8), llrf_afe_reserve_io (X19.7)
RESERVE_2V5_7: llrf_afe_fpga_bridge (U8.A4), llrf_afe_reserve_io (X19.8)
RESERVE_3V3_0: llrf_afe_fpga_bridge (U8.V16), llrf_afe_reserve_io (X18.1)
RESERVE_3V3_1: llrf_afe_fpga_bridge (U8.AB18), llrf_afe_reserve_io (X18.2)
RESERVE_3V3_2: llrf_afe_fpga_bridge (U8.V15), llrf_afe_reserve_io (X18.3)
RESERVE_3V3_3: llrf_afe_fpga_bridge (U8.AA18), llrf_afe_reserve_io (X18.4)
RESERVE_3V3_4: llrf_afe_fpga_bridge (U8.W14), llrf_afe_reserve_io (X18.5)
RESERVE_3V3_5: llrf_afe_fpga_bridge (U8.AB20), llrf_afe_reserve_io (X18.6)
RESERVE_3V3_6: llrf_afe_fpga_bridge (U8.V14), llrf_afe_reserve_io (X18.7)
RESERVE_3V3_7: llrf_afe_fpga_bridge (U8.AA20), llrf_afe_reserve_io (X18.8)
RESERVE_LVDS_0_N: llrf_afe_fpga_bridge (R156.2 U8.U22), llrf_afe_reserve_io (X17.2)
RESERVE_LVDS_0_P: llrf_afe_fpga_bridge (R156.1 U8.U21), llrf_afe_reserve_io (X17.1)
RESERVE_LVDS_1_N: llrf_afe_fpga_bridge (R157.2 U8.V22), llrf_afe_reserve_io (X17.4)
RESERVE_LVDS_1_P: llrf_afe_fpga_bridge (R157.1 U8.V21), llrf_afe_reserve_io (X17.3)
RESERVE_LVDS_2_N: llrf_afe_fpga_bridge (R158.2 U8.W22), llrf_afe_reserve_io (X17.6)
RESERVE_LVDS_2_P: llrf_afe_fpga_bridge (R158.1 U8.W21), llrf_afe_reserve_io (X17.5)
RESERVE_LVDS_3_N: llrf_afe_fpga_bridge (R159.2 U8.Y22), llrf_afe_reserve_io (X17.8)
RESERVE_LVDS_3_P: llrf_afe_fpga_bridge (R159.1 U8.Y21), llrf_afe_reserve_io (X17.7)
rio0: RIO/llrf_rio_ch0 (R26_llrf_rio_ch0.2 X26_llrf_rio_ch0.2), llrf_afe_front_panel (TP9.0 X11.1 X12.5)
rio1: RIO/llrf_rio_ch1 (R26_llrf_rio_ch1.2 X26_llrf_rio_ch1.2), llrf_afe_front_panel (TP10.0 X12.7 X13.1)
rio2: RIO/llrf_rio_ch2 (R26_llrf_rio_ch2.2 X26_llrf_rio_ch2.2), llrf_afe_front_panel (X12.9)
rio3: RIO/llrf_rio_ch3 (R26_llrf_rio_ch3.2 X26_llrf_rio_ch3.2), llrf_afe_front_panel (X12.11)
rio4: RIO/llrf_rio_ch4 (R26_llrf_rio_ch4.2 X26_llrf_rio_ch4.2), llrf_afe_front_panel (X12.13)
rio5: RIO/llrf_rio_ch5 (R26_llrf_rio_ch5.2 X26_llrf_rio_ch5.2), llrf_afe_front_panel (X12.15)
rio6: RIO/llrf_rio_ch6 (R26_llrf_rio_ch6.2 X26_llrf_rio_ch6.2), llrf_afe_front_panel (X12.17)
rio7: RIO/llrf_rio_ch7 (R26_llrf_rio_ch7.2 X26_llrf_rio_ch7.2), llrf_afe_front_panel (X12.19)
SCLK: llrf_afe_fpga_bridge (U8.H2), llrf_afe_dds_clock (U13.16)
SDI: llrf_afe_fpga_bridge (U8.B1), llrf_afe_dds_clock (U13.17)
SDO: llrf_afe_fpga_bridge (U8.B2), llrf_afe_dds_clock (U13.18)
STATUS0: llrf_afe_fpga_bridge (U8.E3), llrf_afe_dds_clock (U13.36)
STATUS1: llrf_afe_fpga_bridge (U8.E4), llrf_afe_dds_clock (U13.35)
SYS_CLK: llrf_afe_main (R166.2), llrf_afe_fpga_bridge (U8.AA11)
SYS_SPI_FMC.SYS_~{CS}_N: llrf_afe_fpga_bridge (U8.F22), llrf_afe_fmc (J1.J7)
SYS_SPI_FMC.SYS_~{CS}_P: llrf_afe_fpga_bridge (U8.F21), llrf_afe_fmc (J1.J6)
SYS_SPI_FMC.SYS_DDS_SYNC_N: llrf_afe_fpga_bridge (U8.K17), llrf_afe_fmc (J1.K11)
SYS_SPI_FMC.SYS_DDS_SYNC_P: llrf_afe_fpga_bridge (U8.K18), llrf_afe_fmc (J1.K10)
SYS_SPI_FMC.SYS_MOSI_N_0: llrf_afe_fpga_bridge (R152.2), llrf_afe_fmc (J1.J10)
SYS_SPI_FMC.SYS_MOSI_N_1: llrf_afe_fpga_bridge (R153.2), llrf_afe_fmc (J1.J13)
SYS_SPI_FMC.SYS_MOSI_N_2: llrf_afe_fpga_bridge (R154.2), llrf_afe_fmc (J1.J16)
SYS_SPI_FMC.SYS_MOSI_N_3: llrf_afe_fpga_bridge (R155.2), llrf_afe_fmc (J1.J19)
SYS_SPI_FMC.SYS_MOSI_P_0: llrf_afe_fpga_bridge (R152.1), llrf_afe_fmc (J1.J9)
SYS_SPI_FMC.SYS_MOSI_P_1: llrf_afe_fpga_bridge (R153.1), llrf_afe_fmc (J1.J12)
SYS_SPI_FMC.SYS_MOSI_P_2: llrf_afe_fpga_bridge (R154.1), llrf_afe_fmc (J1.J15)
SYS_SPI_FMC.SYS_MOSI_P_3: llrf_afe_fpga_bridge (R155.1), llrf_afe_fmc (J1.J18)
SYS_SPI_FMC.SYS_SCLK_N: llrf_afe_fpga_bridge (R181.2 U8.G22), llrf_afe_fmc (J1.J3)
SYS_SPI_FMC.SYS_SCLK_P: llrf_afe_fpga_bridge (R181.1 U8.G21), llrf_afe_fmc (J1.J2)